# EasyEDA Pro project ProPrj_nrf52board_2026-05-24.epro

# Schematic Schematic1
Board Name: Board1; Create Date: 2026-05-19; Page Name: P1; Project Name: nrf52board; Schematic Name: Schematic1; Update Date: 2026-05-21; Company: EasyEDA.com; Page Size: A4; Version: V1.0
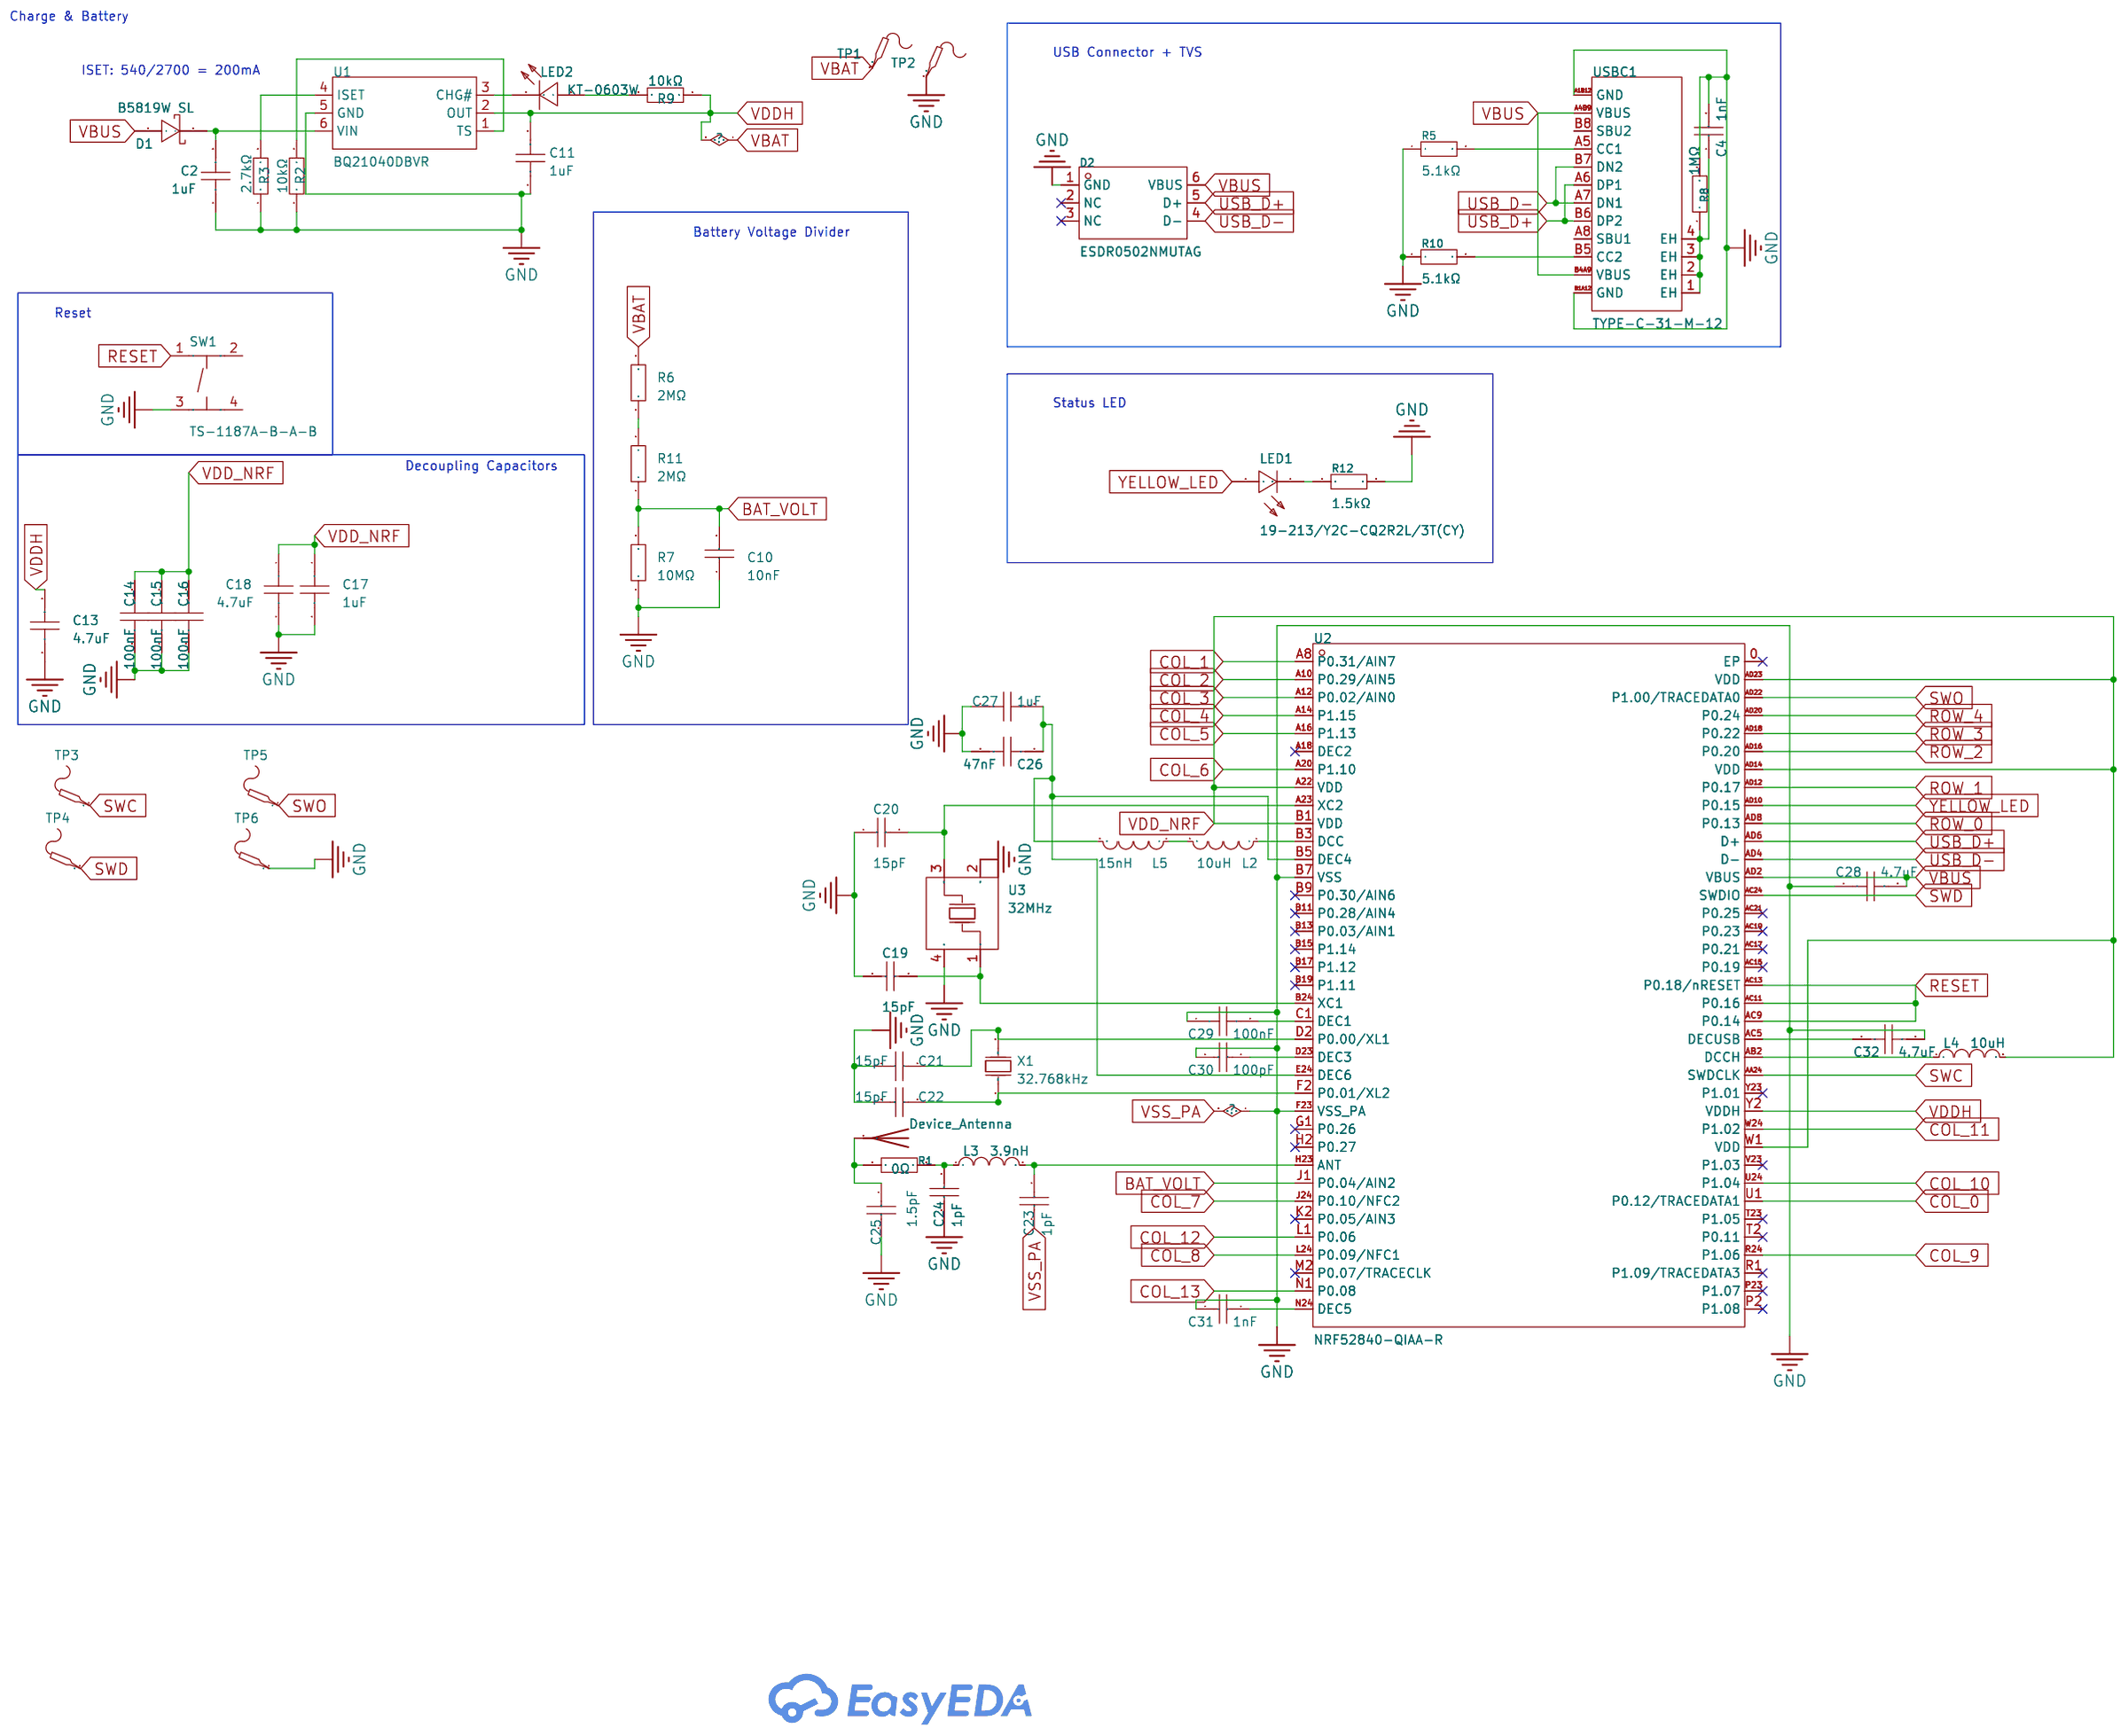
[diagram p0: schematic sheet]

## Parts
AE1  Antenna  [Mikoto-Footprints:2.4GHz-meander-antenna-v2]
C2  1uF  [C0402]
C4  1nF  [C0402]
C10  10nF  [C0402]
C11  1uF  [C0402]
C13  4.7uF  [C0402]
C14  100nF  [C0402]
C15  100nF  [C0402]
C16  100nF  [C0402]
C17  1uF  [C0402]
C18  4.7uF  [C0402]
C19  15pF  [C0402]
C20  15pF  [C0402]
C21  15pF  [C0402]
C22  15pF  [C0402]
C23  1pF  [C0402]
C24  1pF  [C0402]
C25  1.5pF  [C0402]
C26  47nF  [C0402]
C27  1uF  [C0402]
C28  4.7uF  [C0402]
C29  100nF  [C0402]
C30  100pF  [C0402]
C31  1nF  [C0402]
C32  4.7uF  [C0402]
D1  B5819W SL  [SOD-123_L2.7-W1.6-LS3.7-RD-1]
D2  ESDR0502NMUTAG  [UDFN-6_L1.2-W1.0-P0.40-BL]
L2  10uH  [L0603]
L3  3.9nH  [L0402]
L4  10uH  [L0603]
L5  15nH  [L0603]
LED1  19-213/Y2C-CQ2R2L/3T(CY)  [LED0603-RD-YELLOW]
LED2  KT-0603W  [LED0603-R-RD_WHITE]
R1  0Ω  [R0402]
R2  10kΩ  [R0402]
R3  2.7kΩ  [R0603]
R5  5.1kΩ  [R0402]
R6  2MΩ  [R0603]
R7  10MΩ  [R0402]
R8  1MΩ  [R0402]
R9  10kΩ  [R0402]
R10  5.1kΩ  [R0402]
R11  2MΩ  [R0603]
R12  1.5kΩ  [R0402]
SW1  TS-1187A-B-A-B  [SW-SMD_4P-L5.1-W5.1-P3.70-LS6.5-TL_H1.5]
TP1  -  [Test-Point-0.5mm]
TP2  -  [Test-Point-0.5mm]
TP3  -  [Test-Point-0.5mm]
TP4  -  [Test-Point-0.5mm]
TP5  -  [Test-Point-0.5mm]
TP6  -  [Test-Point-0.5mm]
U1  BQ21040DBVR  [SOT-23-6_L2.9-W1.6-P0.95-LS2.8-BR]
U2  NRF52840-QIAA-R  [AQFN-73_L7.0-W7.0-P0.50-BL-EP4.8]
U3  32MHz  [CRYSTAL-SMD_4P-L2.0-W1.6-BL-2]
USBC1  TYPE-C-31-M-12  [USB-C_SMD-TYPE-C-31-M-12_1]
X1  32.768kHz  [FC-12M_L2.0-W1.2]

## Library data of the parts
AE1 = Device_Antenna
C2 C11 C17 C27 = CL05A105KA5NQNC: Capacitance:1uF Tolerance:±10% Tolerance:±10% Voltage Rating:25V Temperature Coefficient:X5R; LCSC Part Name: 1uF ±10% 25V; Supplier Part: C52923; Manufacturer: SAMSUNG(三星); Supplier Footprint: 0402; Datasheet: https://item.szlcsc.com/datasheet/CL05A105KA5NQNC/53938.html; Supplier: LCSC; Tolerance: ±10%; Voltage Rating: 25V; Temperature Coefficient: X5R
C4 C31 = 0402B102K500NT: Capacitance:1nF Tolerance:±10% Tolerance:±10% Voltage Rating:50V Temperature Coefficient:X7R; LCSC Part Name: 1nF ±10% 50V; Supplier Part: C1523; Manufacturer: FH(风华); Supplier Footprint: 0402; Datasheet: https://item.szlcsc.com/datasheet/0402B102K500NT/1875.html; Supplier: LCSC; Tolerance: ±10%; Voltage Rating: 50V; Temperature Coefficient: X7R
C10 = CL05B103KB5NNNC: Capacitance:10nF Tolerance:±10% Tolerance:±10% Voltage Rating:50V Temperature Coefficient:X7R; LCSC Part Name: 10nF ±10% 50V; Supplier Part: C15195; Manufacturer: SAMSUNG(三星); Supplier Footprint: 0402; Datasheet: https://item.szlcsc.com/datasheet/CL05B103KB5NNNC/15869.html; Supplier: LCSC; Tolerance: ±10%; Voltage Rating: 50V; Temperature Coefficient: X7R
C13 C18 C28 C32 = CL05A475MP5NRNC: Capacitance:4.7uF Tolerance:±20% Tolerance:±20% Voltage Rating:10V Temperature Coefficient:X5R; LCSC Part Name: 4.7uF ±20% 10V; Supplier Part: C23733; Manufacturer: SAMSUNG(三星); Supplier Footprint: 0402; Datasheet: https://item.szlcsc.com/datasheet/CL05A475MP5NRNC/24469.html; Supplier: LCSC; Tolerance: ±20%; Voltage Rating: 10V; Temperature Coefficient: X5R
C14-C16 C29 = CL05B104KB54PNC: Capacitance:100nF Tolerance:±10% Tolerance:±10% Voltage Rating:50V Temperature Coefficient:X7R; LCSC Part Name: 100nF ±10% 50V; Supplier Part: C307331; Manufacturer: SAMSUNG(三星); Supplier Footprint: 0402; Datasheet: https://item.szlcsc.com/datasheet/CL05B104KB54PNC/291005.html; Supplier: LCSC; Tolerance: ±10%; Voltage Rating: 50V; Temperature Coefficient: X7R
C19-C22 = 0402CG150J500NT: Capacitance:15pF Tolerance:±5% Tolerance:±5% Voltage Rating:50V Temperature Coefficient:C0G; LCSC Part Name: 15pF ±5% 50V; Supplier Part: C1548; Manufacturer: FH(风华); Supplier Footprint: 0402; Datasheet: https://item.szlcsc.com/datasheet/0402CG150J500NT/1900.html; Supplier: LCSC; Tolerance: ±5%; Voltage Rating: 50V; Temperature Coefficient: C0G
C23 C24 = 0402CG1R0C500NT: Capacitance:1pF Voltage Rating:50V Temperature Coefficient:C0G; LCSC Part Name: ±0.25pF 1pF 50V; Supplier Part: C1550; Manufacturer: FH(风华); Supplier Footprint: 0402; JLCPCB Part Class: Extended Part; Datasheet: https://item.szlcsc.com/datasheet/0402CG1R0C500NT/1902.html; Supplier: LCSC; Voltage Rating: 50V; Temperature Coefficient: C0G
C25 = 0402CG1R5C500NT: Capacitance:1.5pF Voltage Rating:50V Temperature Coefficient:C0G; LCSC Part Name: ±0.25pF 1.5pF 50V; Supplier Part: C1552; Manufacturer: FH(风华); Supplier Footprint: 0402; JLCPCB Part Class: Extended Part; Datasheet: https://item.szlcsc.com/datasheet/0402CG1R5C500NT/1904.html; Supplier: LCSC; Voltage Rating: 50V; Temperature Coefficient: C0G
C26 = CC0402KRX7R9BB473: Capacitance:47nF Tolerance:±10% Tolerance:±10% Voltage Rating:50V Temperature Coefficient:X7R; LCSC Part Name: 47nF ±10% 50V; Supplier Part: C272875; Manufacturer: YAGEO(国巨); Supplier Footprint: 0402; Datasheet: https://item.szlcsc.com/datasheet/CC0402KRX7R9BB473/261267.html; Supplier: LCSC; Tolerance: ±10%; Voltage Rating: 50V; Temperature Coefficient: X7R
C30 = 0402CG101J500NT: Capacitance:100pF Tolerance:±5% Tolerance:±5% Voltage Rating:50V Temperature Coefficient:C0G; LCSC Part Name: 100pF ±5% 50V; Supplier Part: C1546; Manufacturer: FH(风华); Supplier Footprint: 0402; Datasheet: https://item.szlcsc.com/datasheet/0402CG101J500NT/1898.html; Supplier: LCSC; Tolerance: ±5%; Voltage Rating: 50V; Temperature Coefficient: C0G
D1 = B5819W SL: Voltage - Forward(Vf@If):600mV@1A Voltage - DC Reverse(Vr):40V Current - Rectified:1A Non-Repetitive Peak Forward Surge Current:9A; LCSC Part Name: 电压:40V 电流:1A; Supplier Part: C8598; Manufacturer: CJ(江苏长电/长晶); Supplier Footprint: SOD-123; JLCPCB Part Class: Basic Part; Datasheet: https://item.szlcsc.com/datasheet/B5819W%2520SL/9093.html; Supplier: LCSC; Voltage - Forward(Vf@If): 600mV@1A; Voltage - DC Reverse(Vr): 40V; Current - Rectified: 1A; Non-Repetitive Peak Forward Surge Current: 9A
D2 = ESDR0502NMUTAG: Polarity:Unidirectional Reverse Stand-Off Voltage (Vrwm):5.5V Clamping Voltage:- Peak Pulse Current (Ipp):3A@8/20us Peak Pulse Power Dissipation (Ppp):100W Voltage - Breakdown:6V Reverse Leakage Current (Ir):1uA Number of Channels:3.0 Operating Temperatur; LCSC Part Name: 单向ESD 5.5V截止 峰值脉冲电流：3A@8/20us; Supplier Part: C94372; Manufacturer: onsemi(安森美); Supplier Footprint: UDFN-6(1x1.2); Datasheet: https://item.szlcsc.com/datasheet/ESDR0502NMUTAG/95570.html; Supplier: LCSC; Polarity: Unidirectional; Reverse Stand-Off Voltage (Vrwm): 5.5V; Peak Pulse Current (Ipp): 3A@8/20us; Peak Pulse Power Dissipation (Ppp): 100W; Voltage - Breakdown: 6V; Reverse Leakage Current (Ir): 1uA; Number of Channels: 3.0; Operating Temperature: -40℃~+125℃@(Tj); level of protection: IEC 61000-4-2; Type: ESD; Junction Capacitance: 0.3pF
L2 L4 = MLF1608E100KTD00: Inductance: Tolerance:±10% Tolerance:±10% Rated Current: Saturation Current (Isat):- DC Resistance (DCR): Q @ Freq:30@2MHz Frequency - Self Resonant: Ratings:; LCSC Part Name: 10uH ±10%; Supplier Part: C76732; Manufacturer: TDK; Supplier Footprint: 0603; JLCPCB Part Class: Extended Part; Datasheet: https://atta.szlcsc.com/upload/public/pdf/source/20181114/C275341_888357AD71868412430D27D805FD440F.pdf; Supplier: LCSC; Tolerance: ±10%; Q @ Freq: 30@2MHz
L3 = MLG1005S3N9BT000: Inductance: Tolerance:- Tolerance:- Current Rating: Current - Saturation (Isat):- DC Resistance(DCR): Q @ Frequency:8@100MHz Frequency - Self Resonant:5GHz Ratings:; LCSC Part Name: ±0.1nH 3.9nH; Supplier Part: C76775; Manufacturer: TDK; Supplier Footprint: 0402; Datasheet: https://atta.szlcsc.com/upload/public/pdf/source/20240116/5498F69597B6145D9954BDAE22913204.pdf; Supplier: LCSC; Q @ Frequency: 8@100MHz; Frequency - Self Resonant: 5GHz
L5 = MLG1005S15NJT000: Inductance: Tolerance:±5% Tolerance:±5% Rated Current: Saturation Current (Isat):- DC Resistance (DCR): Q @ Freq:8@100MHz Frequency - Self Resonant: Ratings:; LCSC Part Name: 15nH ±5%; Supplier Part: C76763; Manufacturer: TDK; Supplier Footprint: 0402; Datasheet: https://atta.szlcsc.com/upload/public/pdf/source/20190403/C275259_14D38AC9DF218780897673DFAA345BA3.pdf; Supplier: LCSC; Tolerance: ±5%; Q @ Freq: 8@100MHz
LED1 = 19-213/Y2C-CQ2R2L/3T(CY): Lamp Holder Type:- Illumination Color:Yellow Voltage - Forward(Vf):1.7V~2.3V Voltage - Forward(Vf):1.7V~2.3V Power(Watts):60mW Forward Current:20mA Wavelength - Dominant:585.5nm~591.5nm Wavelength - Dominant:585.5nm~591.5nm Peak Wavelength:591nm Peak Wave; LCSC Part Name: 黄灯; Supplier Part: C72038; Manufacturer: EVERLIGHT(亿光); Supplier Footprint: 0603; Supplier: LCSC; Illumination Color: Yellow; Voltage - Forward(Vf): 1.7V~2.3V; Power(Watts): 60mW; Forward Current: 20mA; Wavelength - Dominant: 585.5nm~591.5nm; Peak Wavelength: 591nm; Lens Color: Water Clear; Luminous Intensity: 90mcd~180mcd; Viewing Angle: 120°; Operating Temperature: -40℃~+85℃
LED2 = KT-0603W: Lamp Holder Type:1.6mm x 0.8mm square LED Illumination Color:White Voltage - Forward(Vf):2.6V~3.1V Voltage - Forward(Vf):2.6V~3.1V Power(Watts):100mW Forward Current:5mA Wavelength - Dominant:- Wavelength - Dominant:- Peak Wavelength:- Peak Wavelength:- D; LCSC Part Name: 0603 白灯 高亮; Supplier Part: C2290; Manufacturer: KENTO; Supplier Footprint: 0603; Datasheet: https://item.szlcsc.com/datasheet/KT-0603W/2663.html; Supplier: LCSC; Lamp Holder Type: 1.6mm x 0.8mm square LED; Illumination Color: White; Voltage - Forward(Vf): 2.6V~3.1V; Power(Watts): 100mW; Forward Current: 5mA; Diode Configuration: Discrete Diode; Lens Color: Yellow Lens; Color Temperature: 40000K~100000K; Luminous Intensity: 360mcd; Viewing Angle: 120°; Mounting Style: Top-mount; Operating Temperature: -40℃~+85℃
R1 = 0402WGF0000TCE: Type:Thick Film Resistor Resistance:0Ω Tolerance:±1% Tolerance:±1% Power(Watts):62.5mW Voltage-Supply(Max):50V Temperature Coefficient:±800ppm/℃ Temperature Coefficient:±800ppm/℃ Operating Temperature:-55℃~+155℃ Operating Temperature:-55℃~+155℃; LCSC Part Name: 0Ω ±1% 62.5mW 厚膜电阻; Supplier Part: C17168; Manufacturer: UNI-ROYAL(厚声); Supplier Footprint: 0402; Datasheet: https://item.szlcsc.com/datasheet/0402WGF0000TCE/17853.html; Supplier: LCSC; Type: Thick Film Resistor; Tolerance: ±1%; Power(Watts): 62.5mW; Voltage-Supply(Max): 50V; Temperature Coefficient: ±800ppm/℃; Operating Temperature: -55℃~+155℃
R2 R9 = 0402WGF1002TCE: Type:Thick Film Resistor Resistance:10kΩ Tolerance:±1% Tolerance:±1% Power(Watts):62.5mW Voltage-Supply(Max):50V Temperature Coefficient:±100ppm/℃ Temperature Coefficient:±100ppm/℃ Operating Temperature:-55℃~+155℃ Operating Temperature:-55℃~+155℃; LCSC Part Name: 10kΩ ±1% 62.5mW 厚膜电阻; Supplier Part: C25744; Manufacturer: UNI-ROYAL(厚声); Supplier Footprint: 0402; Datasheet: https://item.szlcsc.com/datasheet/0402WGF1002TCE/26487.html; Supplier: LCSC; Type: Thick Film Resistor; Tolerance: ±1%; Power(Watts): 62.5mW; Voltage-Supply(Max): 50V; Temperature Coefficient: ±100ppm/℃; Operating Temperature: -55℃~+155℃
R3 = 0603WAF2701T5E: Type:Thick Film Resistor Resistance:2.7kΩ Tolerance:±1% Tolerance:±1% Power(Watts):100mW Voltage-Supply(Max):75V Temperature Coefficient:±100ppm/℃ Temperature Coefficient:±100ppm/℃ Operating Temperature:-55℃~+155℃ Operating Temperature:-55℃~+155℃; LCSC Part Name: 2.7kΩ ±1% 100mW 厚膜电阻; Supplier Part: C13167; Manufacturer: UNI-ROYAL(厚声); Supplier Footprint: 0603; Datasheet: https://item.szlcsc.com/datasheet/0603WAF2701T5E/13814.html; Supplier: LCSC; Type: Thick Film Resistor; Tolerance: ±1%; Power(Watts): 100mW; Voltage-Supply(Max): 75V; Temperature Coefficient: ±100ppm/℃; Operating Temperature: -55℃~+155℃
R5 R10 = 0402WGF5101TCE: Type:Thick Film Resistor Resistance:5.1kΩ Tolerance:±1% Tolerance:±1% Power(Watts):62.5mW Voltage-Supply(Max):50V Temperature Coefficient:±100ppm/℃ Temperature Coefficient:±100ppm/℃ Operating Temperature:-55℃~+155℃ Operating Temperature:-55℃~+155℃; LCSC Part Name: 5.1kΩ ±1% 62.5mW 厚膜电阻; Supplier Part: C25905; Manufacturer: UNI-ROYAL(厚声); Supplier Footprint: 0402; Datasheet: https://item.szlcsc.com/datasheet/0402WGF5101TCE/26648.html; Supplier: LCSC; Type: Thick Film Resistor; Tolerance: ±1%; Power(Watts): 62.5mW; Voltage-Supply(Max): 50V; Temperature Coefficient: ±100ppm/℃; Operating Temperature: -55℃~+155℃
R6 R11 = 0603WAF2004T5E: Type:Thick Film Resistor Resistance:2MΩ Tolerance:±1% Tolerance:±1% Power(Watts):100mW Voltage-Supply(Max):75V Temperature Coefficient:±100ppm/℃ Temperature Coefficient:±100ppm/℃ Operating Temperature:-55℃~+155℃ Operating Temperature:-55℃~+155℃; LCSC Part Name: 2MΩ ±1% 100mW 厚膜电阻; Supplier Part: C22976; Manufacturer: UNI-ROYAL(厚声); Supplier Footprint: 0603; Datasheet: https://item.szlcsc.com/datasheet/0603WAF2004T5E/23703.html; Supplier: LCSC; Type: Thick Film Resistor; Tolerance: ±1%; Power(Watts): 100mW; Voltage-Supply(Max): 75V; Temperature Coefficient: ±100ppm/℃; Operating Temperature: -55℃~+155℃
R7 = 0402WGF1005TCE: Type:Thick Film Resistor Resistance:10MΩ Tolerance:±1% Tolerance:±1% Power(Watts):62.5mW Voltage-Supply(Max):50V Temperature Coefficient:±200ppm/℃ Temperature Coefficient:±200ppm/℃ Operating Temperature:-55℃~+155℃ Operating Temperature:-55℃~+155℃; LCSC Part Name: 10MΩ ±1% 62.5mW 厚膜电阻; Supplier Part: C26082; Manufacturer: UNI-ROYAL(厚声); Supplier Footprint: 0402; Datasheet: https://item.szlcsc.com/datasheet/0402WGF1005TCE/26825.html; Supplier: LCSC; Type: Thick Film Resistor; Tolerance: ±1%; Power(Watts): 62.5mW; Voltage-Supply(Max): 50V; Temperature Coefficient: ±200ppm/℃; Operating Temperature: -55℃~+155℃
R8 = 0402WGF1004TCE: Type:Thick Film Resistor Resistance:1MΩ Tolerance:±1% Tolerance:±1% Power(Watts):62.5mW Voltage-Supply(Max):50V Temperature Coefficient:±100ppm/℃ Temperature Coefficient:±100ppm/℃ Operating Temperature:-55℃~+155℃ Operating Temperature:-55℃~+155℃; LCSC Part Name: 1MΩ ±1% 62.5mW 厚膜电阻; Supplier Part: C26083; Manufacturer: UNI-ROYAL(厚声); Supplier Footprint: 0402; Datasheet: https://item.szlcsc.com/datasheet/0402WGF1004TCE/26826.html; Supplier: LCSC; Type: Thick Film Resistor; Tolerance: ±1%; Power(Watts): 62.5mW; Voltage-Supply(Max): 50V; Temperature Coefficient: ±100ppm/℃; Operating Temperature: -55℃~+155℃
R12 = 0402WGF1501TCE: Type:Thick Film Resistors Resistance:1.5kΩ Tolerance:±1% Tolerance:±1% Power(Watts): Overload Voltage (Max): Temperature Coefficient:±100ppm/℃ Temperature Coefficient:±100ppm/℃ Operating Temperature Range:-55℃~+155℃ Operating Temperature Range:-55℃~+155℃; LCSC Part Name: 1.5kΩ ±1% 62.5mW 厚膜电阻; Supplier Part: C25867; Manufacturer: UNI-ROYAL(厚声); Supplier Footprint: 0402; Datasheet: https://atta.szlcsc.com/upload/public/pdf/source/20200306/C422600_1E6D84923E4A46A82E41ADD87F860B5C.pdf; Supplier: LCSC; Type: Thick Film Resistors; Tolerance: ±1%; Temperature Coefficient: ±100ppm/℃; Operating Temperature Range: -55℃~+155℃
SW1 = TS-1187A-B-A-B: Circuit:SPST Actuator Style:Round Button Operating Force:1.6N Mounting Type:Surface Mount,Vertical Length:5.1mm Width:5.1mm Switch Height:1.5mm with Bracket:Without Bracket Contact Current:50mA Voltage Rating:12V Actuator/Cap Color:Gold With Lamp:No Life:; LCSC Part Name: 5.1*5.1*1.5mm 立贴 轻触开关; Supplier Part: C318884; Manufacturer: XKB Connection(中国星坤); Supplier Footprint: SMD; Datasheet: https://item.szlcsc.com/datasheet/TS-1187A-B-A-B/299976.html; Supplier: LCSC; Circuit: SPST; Actuator Style: Round Button; Operating Force: 1.6N; Mounting Type: Surface Mount,Vertical; Length: 5.1mm; Width: 5.1mm; Switch Height: 1.5mm; with Bracket: Without Bracket; Contact Current: 50mA; Voltage Rating: 12V; Actuator/Cap Color: Gold; With Lamp: No; Life: 100,000 Cycles; Operating Temperature: -30℃~+85℃
TP1-TP6 = Test-Point: Test Point 测试点
U1 = BQ21040DBVR: The Chip Type:Charging IC Voltage - Supply:3.5V~28V Voltage - Supply:3.5V~28V Charge Current - Max:800mA Charging Saturation Voltage:4.2V End-Off Voltage:- Type of Battery:Lithium Battery Number of Cells:1 Number of Cells:1 Operating Temperature:0℃~+125℃; LCSC Part Name: 单输入单节锂离子和锂聚合物电池充电器; Supplier Part: C202311; Manufacturer: TI(德州仪器); Supplier Footprint: SOT-23-6; Datasheet: https://www.ti.com/cn/lit/gpn/bq21040; Supplier: LCSC; The Chip Type: Charging IC; Voltage - Supply: 3.5V~28V; Charge Current - Max: 800mA; Charging Saturation Voltage: 4.2V; Type of Battery: Lithium Battery; Number of Cells: 1; Operating Temperature: 0℃~+125℃; Battery Temperature Detection: Support; Supply Current (Iq): 125uA
U2 = NRF52840-QIAA-R: Frequency Range:2.4GHz~2.4835GHz Frequency Range:2.4GHz~2.4835GHz Interface:ADC；SPI；PWM；I2S；USB；UART Voltage - Supply:1.7V~5.5V Voltage - Supply:1.7V~5.5V Applications:ISM；Bluetooth；ZigBee；IoT；LoRa Output Power:8dBm Data Rate:2Mbps Current Of Transmitting; LCSC Part Name: 蓝牙，IEEE 802.15.4-2006，2.4GHz收发器; Supplier Part: C190794; Manufacturer: NORDIC; Supplier Footprint: AQFN-73-EP(7x7); Datasheet: https://item.szlcsc.com/datasheet/NRF52840-QIAA-R/213038.html; Supplier: LCSC; Frequency Range: 2.4GHz~2.4835GHz; Interface: ADC；SPI；PWM；I2S；USB；UART; Voltage - Supply: 1.7V~5.5V; Applications: ISM；Bluetooth；ZigBee；IoT；LoRa; Output Power: 8dBm; Data Rate: 2Mbps; Current Of Transmitting: 4.82mA; Sensitivity: -95dBm; Receive Current: 6.26mA; Typical Application Frequency: 2.4GHz; Type: transceiver
U3 = XL7EL89COI-111YLC-32M: Type:Crystal Oscillator Frequency:32MHz Normal temperature Frequency Tolerance:±10ppm Normal temperature Frequency Tolerance:±10ppm Load Capacitance:12pF Frequency Stability:±20ppm Frequency Stability:±20ppm Equivalent Series Resistance(ESR):- Operating T; LCSC Part Name: YSX211SL 32MHZ 12PF ±10PPM -40~85℃; Supplier Part: C2965584; Manufacturer: YXC(扬兴晶振); Supplier Footprint: SMD2016-4P; Datasheet: https://item.szlcsc.com/datasheet/XL7EL89COI-111YLC-32M/3357720.html; Supplier: LCSC; Type: Crystal Oscillator; Normal temperature Frequency Tolerance: ±10ppm; Load Capacitance: 12pF; Frequency Stability: ±20ppm; Operating Temperature: -40℃~+85℃
USBC1 = TYPE-C-31-M-12: Connector Type:Type-C Protocol Standard:- Gender:Female Mounting Type:Surface Mount, Right Angle Number of Contacts:16P Number of Ports:1 Current Rating-Power:5A Voltage Rating:20V Connect-Disconnect Life:10,000 cycles Length:7.35mm Operating Temperature:; LCSC Part Name: Type-C 母 卧贴; Supplier Part: C165948; Manufacturer: 韩国韩荣; Supplier Footprint: SMD; Datasheet: https://item.szlcsc.com/datasheet/TYPE-C-31-M-12/177331.html; Supplier: LCSC; Connector Type: Type-C; Gender: Female; Mounting Type: Surface Mount, Right Angle; Number of Contacts: 16P; Number of Ports: 1; Current Rating-Power: 5A; Voltage Rating: 20V; Connect-Disconnect Life: 10,000 cycles; Length: 7.35mm; Operating Temperature: -30℃~+80℃
X1 = X1A0000610006: Type:Crystal Oscillator Frequency:32.768kHz Normal temperature Frequency Tolerance:±20ppm Normal temperature Frequency Tolerance:±20ppm Load Capacitance:7pF Equivalent Series Resistance(ESR):90kΩ Operating Temperature:-40℃~+85℃ Operating Temperature:-40℃~; LCSC Part Name: 32.768kHz ±20ppm 7pF; Supplier Part: C99009; Manufacturer: EPSON(爱普生); Supplier Footprint: SMD2012-2P; Datasheet: https://item.szlcsc.com/datasheet/X1A0000610006/100221.html; Supplier: LCSC; Type: Crystal Oscillator; Normal temperature Frequency Tolerance: ±20ppm; Load Capacitance: 7pF; Equivalent Series Resistance(ESR): 90kΩ; Operating Temperature: -40℃~+85℃

## Nets
GND: C2.1 C4.2 C10.1 C11.1 C13.1 C14.1 C15.1 C16.1 C17.2 C18.2 C19.1 C20.1 C21.1 C22.1 C23.1 C24.1 C25.1 C26.2 C27.1 C28.1 C29.1 C30.1 C31.1 C32.2 D2.1(GND) R2.1 R3.1 R5.1 R7.1 R8.2 R10.1 R12.2 SW1.3(C) TP2.1 TP6.1 U1.5(GND) U2.B7(VSS) U2.F23(VSS_PA) U3.2(GND) U3.4(GND) USBC1.A1B12(GND) USBC1.B1A12(GND)
VBAT: C11.2 C13.2 R6.2 R9.1 TP1.1 U1.2(OUT) U2.Y2(VDDH)
VBUS: C28.2 D1.2(+) D2.6(VBUS) U2.AD2(VBUS) USBC1.A4B9(VBUS) USBC1.B4A9(VBUS)
VDD_NRF: C14.2 C15.2 C16.2 C17.1 C18.1 L4.2 U2.A22(VDD) U2.AD14(VDD) U2.AD23(VDD) U2.B1(VDD) U2.W1(VDD)
BAT_VOLT: C10.2 R7.2 R11.1 U2.J1(P0.04/AIN2)
COL_0: U2.U1(P0.12/TRACEDATA1)
COL_1: U2.A8(P0.31/AIN7)
COL_2: U2.A10(P0.29/AIN5)
COL_3: U2.A12(P0.02/AIN0)
COL_4: U2.A14(P1.15)
COL_5: U2.A16(P1.13)
COL_6: U2.A20(P1.10)
COL_7: U2.J24(P0.10/NFC2)
COL_8: U2.L24(P0.09/NFC1)
COL_9: U2.R24(P1.06)
COL_10: U2.U24(P1.04)
COL_11: U2.W24(P1.02)
COL_12: U2.L1(P0.06)
COL_13: U2.N1(P0.08)
RESET: SW1.1(A) U2.AC9(P0.14) U2.AC11(P0.16) U2.AC13(P0.18/nRESET)
ROW_0: U2.AD8(P0.13)
ROW_1: U2.AD12(P0.17)
ROW_2: U2.AD16(P0.20)
ROW_3: U2.AD18(P0.22)
ROW_4: U2.AD20(P0.24)
SWC: TP3.1 U2.AA24(SWDCLK)
SWD: TP4.1 U2.AC24(SWDIO)
SWO: TP5.1 U2.AD22(P1.00/TRACEDATA0)
USB_D+: D2.5(D+) U2.AD6(D+) USBC1.A6(DP1) USBC1.B6(DP2)
USB_D-: D2.4(D-) U2.AD4(D-) USBC1.A7(DN1) USBC1.B7(DN2)
YELLOW_LED: LED1.2(A) U2.AD10(P0.15)
$1N6787: R2.2 U1.1(TS)
$1N6836: R3.2 U1.4(ISET)
$1N6843: C2.2 D1.1(-) U1.6(VIN)
$1N6965: LED2.2(K) U1.3(CHG#)
$1N7006: LED2.1(A) R9.2
$1N7414: R10.2 USBC1.B5(CC2)
$1N7418: R5.2 USBC1.A5(CC1)
$1N7519: C4.1 R8.1 USBC1.1(EH) USBC1.2(EH) USBC1.3(EH) USBC1.4(EH)
$1N7677: R6.1 R11.2
$1N7805: LED1.1(C) R12.1
$1N8689: C20.2 U2.A23(XC2) U3.3(OSC2)
$1N8693: C19.2 U2.B24(XC1) U3.1(OSC1)
$1N8922: C21.2 U2.D2(P0.00/XL1) X1.2(OSC2)
$1N8937: C22.2 U2.F2(P0.01/XL2) X1.1(OSC1)
$1N9163: C23.2 L3.2 U2.H23(ANT)
$1N9226: C24.2 L3.1 R1.2
$1N9400: L4.1 U2.AB2(DCCH)
$1N9460: L2.1 U2.B3(DCC)
$1N9502: L2.2 L5.1
$1N9506: C26.1 C27.2 L5.2 U2.B5(DEC4) U2.E24(DEC6)
$1N9889: C29.2 U2.C1(DEC1)
$1N9928: C30.2 U2.D23(DEC3)
$1N9989: C31.2 U2.N24(DEC5)
$1N10054: C32.1 U2.AC5(DECUSB)
Net-(AE1-1): AE1.1(A) C25.2 R1.1

Not connected (* = marked no-connect by the designer): D2 2(NC)* 3(NC)*; SW1 2(B) 4(D); U2 0(EP)* A18(DEC2)* AC15(P0.19)* AC17(P0.21)* AC19(P0.23)* AC21(P0.25)* B9(P0.30/AIN6)* B11(P0.28/AIN4)* B13(P0.03/AIN1)* B15(P1.14)* B17(P1.12)* B19(P1.11)* G1(P0.26)* H2(P0.27)* K2(P0.05/AIN3)* M2(P0.07/TRACECLK)* P2(P1.08)* P23(P1.07)* R1(P1.09/TRACEDATA3)* T2(P0.11)* T23(P1.05)* V23(P1.03)* Y23(P1.01)*; USBC1 A8(SBU1) B8(SBU2)

## Notes on the sheet
- Charge & Battery
- USB Connector + TVS
- ISET: 540/2700 = 200mA
- Battery Voltage Divider
- Reset
- Status LED
- Decoupling Capacitors

# Board PCB1
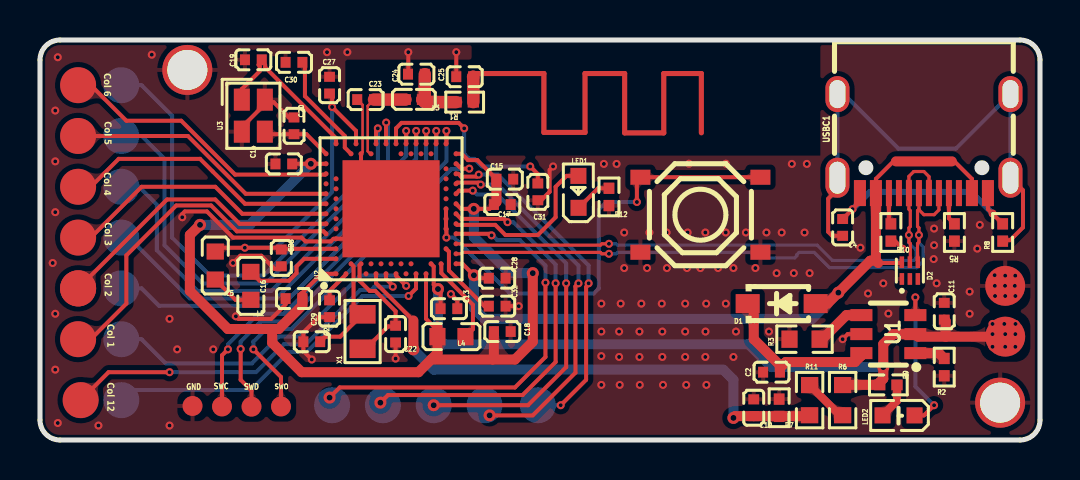
[diagram p1: board, top side]
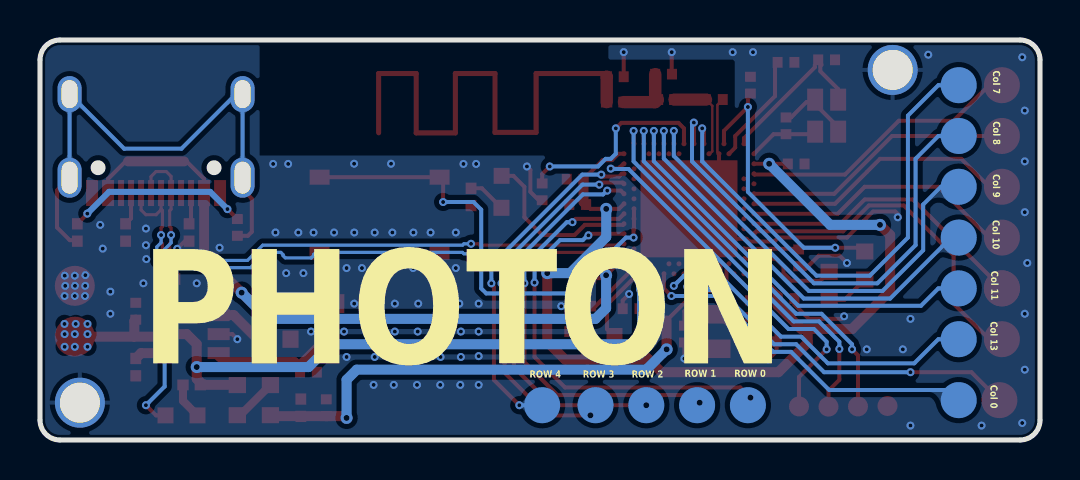
[diagram p2: board, bottom side, seen from below]

Outline 50 x 20 mm; copper layers: Top Layer, Bottom Layer. Coordinates in mm from the lower left corner of the outline.
Outline path: 0,19 0,1 arc(0.29,0.29) 1,0 49,0 arc(49.71,0.29) 50,1 50,19 arc(49.71,19.71) 49,20 1,20 arc(0.29,19.71) 0,19
Stack: Top Layer 0.035mm / Dielectric1 1.51mm FR4 er 4.5 / Bottom Layer 0.035mm

## Design rules (mm)
net USB_D-: DP1
net USB_D+: DP1
template: Custom Config
spacing copperThickness1oz (default): track to track 0.1, other pairs 0.1 to 0.3
spacing copperThickness2oz: track to track 0.203, other pairs 0.152 to 0.3
track width copperThickness1oz (default): min 0.127, default 0.2, max 2.54
track width copperThickness2oz: min 0.203, default 0.254, max 2.54
differential pair differentialPair (default): width min 0.127, default 0.158, max 2.54; gap min 0.203, default 0.203
via viaSize (default): diameter min 0.4, default 0.4, max 10; hole min 0.2, default 0.2, max 6.3

## Placement (name value [footprint] x y rotation side)
AE1  Antenna  [mikoto-footprints:2.4GHz-meander-antenna-v2]  28.19 16.85 180 top
C2  1uF  [C0402]  36.58 3.39 0 top
C4  1nF  [C0402]  40.13 10.63 90 top
C10  10nF  [C0402]  35.69 1.61 270 top
C11  1uF  [C0402]  45.21 6.44 270 top
C13  4.7uF  [C0402]  20.45 6.56 180 top
C14  100nF  [C0402]  12.19 13.8 0 top
C15  100nF  [C0402]  23.24 13.04 180 top
C16  100nF  [C0402]  12.7 7.07 0 top
C17  1uF  [C0402]  23.11 11.77 0 top
C18  4.7uF  [C0402]  23.11 5.42 0 top
C19  15pF  [C0402]  10.67 19.01 0 top
C20  15pF  [C0402]  12.7 15.71 270 top
C21  15pF  [C0402]  13.59 4.91 0 top
C22  15pF  [C0402]  17.78 5.3 90 top
C23  1pF  [C0402]  16.28 17.02 0 top
C24  1pF  [C0402]  18.82 18.29 0 top
C25  1.5pF  [C0402]  21.23 18.16 0 top
C26  47nF  [C0402]  12.06 9.11 270 top
C27  1uF  [C0402]  14.48 17.74 270 top
C28  4.7uF  [C0402]  22.86 8.09 180 top
C29  100nF  [C0402]  14.48 6.56 90 top
C30  100pF  [C0402]  12.7 18.88 0 top
C31  1nF  [C0402]  24.89 12.41 90 top
C32  4.7uF  [C0402]  22.86 6.69 0 top
D1  B5819W SL  [SOD-123_L2.7-W1.6-LS3.7-RD-1]  37.08 6.82 0 top
D2  ESDR0502NMUTAG  [UDFN-6_L1.2-W1.0-P0.40-BL]  43.49 8.47 0 top
GND  -  [Test-Point-0.5mm]  7.63 1.7 0 top
L2  10uH  [L0603]  10.54 7.71 270 top
L3  3.9nH  [L0402]  18.69 17.02 180 top
L4  10uH  [L0603]  20.57 5.17 180 top
L5  15nH  [L0603]  8.76 8.72 90 top
LED1  19-213/Y2C-CQ2R2L/3T(CY)  [LED0603-RD-YELLOW]  26.92 12.41 90 top
LED2  KT-0603W  [LED0603-R-RD_WHITE]  42.93 1.23 180 top
NOREF  -  [Pad_e2406]  1.91 5.04 0 top
NOREF#2  -  [Pad_e2405]  4.06 17.74 0 top
NOREF#3  -  [Pad_e632]  48.26 7.71 90 top
NOREF#4  -  [Pad_e2399]  4.06 5.04 0 top
NOREF#5  -  [Pad_e629]  48.26 5.17 90 top
NOREF#6  -  [Pad_e2394]  22.22 1.74 0 top
NOREF#7  -  [Pad_e2409]  1.91 10.12 0 top
NOREF#8  -  [Pad_e2395]  19.69 1.74 0 top
NOREF#9  -  [Pad_e2411]  1.91 15.2 0 top
NOREF#10  -  [Pad_e2401]  4.06 7.58 0 top
NOREF#11  -  [Pad_e2404]  4.06 15.2 0 top
NOREF#12  -  [Pad_e2410]  1.91 12.66 0 top
NOREF#13  -  [Pad_e2392]  24.89 1.74 0 top
NOREF#14  -  [Pad_e2397]  14.61 1.74 0 top
NOREF#15  -  [Pad_e7702]  7.37 18.5 0 top
NOREF#16  -  [Pad_e1312]  48.01 1.87 0 top
NOREF#17  -  [Pad_e2407]  1.91 7.58 0 top
NOREF#18  -  [Pad_e2398]  4.06 1.99 0 top
NOREF#19  -  [Pad_e2403]  4.06 12.66 0 top
NOREF#20  -  [Pad_e2402]  4.06 10.12 0 top
NOREF#21  -  [Pad_e2408]  1.91 7.58 0 top
NOREF#22  -  [Pad_e2396]  17.15 1.74 0 top
NOREF#23  -  [Pad_e2400]  2.03 1.99 0 top
NOREF#24  -  [Pad_e2412]  1.91 17.74 0 top
R1  0Ω  [R0402]  21.23 16.89 180 top
R2  10kΩ  [R0402]  45.21 3.64 90 top
R3  2.7kΩ  [R0603]  38.23 5.04 0 top
R5  5.1kΩ  [R0402]  45.72 10.38 90 top
R6  2MΩ  [R0603]  40.13 1.99 90 top
R7  10MΩ  [R0402]  36.96 1.61 270 top
R8  1MΩ  [R0402]  48.13 10.38 90 top
R9  10kΩ  [R0402]  42.42 2.75 0 top
R10  5.1kΩ  [R0402]  42.55 10.38 90 top
R11  2MΩ  [R0603]  38.48 1.99 90 top
R12  1.5kΩ  [R0402]  28.45 12.15 270 top
SW1  TS-1187A-B-A-B  [SW-SMD_4P-L5.1-W5.1-P3.70-LS6.5-TL_H1.5]  33.02 11.26 0 top
SWC  -  [Test-Point-0.5mm]  9.1 1.68 0 top
SWD  -  [Test-Point-0.5mm]  10.58 1.67 0 top
SWO  -  [Test-Point-0.5mm]  12.05 1.68 0 top
U1  BQ21040DBVR  [SOT-23-6_L2.9-W1.6-P0.95-LS2.8-BR]  42.42 5.3 0 top
U2  NRF52840-QIAA-R  [AQFN-73_L7.0-W7.0-P0.50-BL-EP4.8]  17.55 11.56 0 top
U3  32MHz  [CRYSTAL-SMD_4P-L2.0-W1.6-BL-2]  10.67 16.22 270 top
USBC1  TYPE-C-31-M-12  [USB-C_SMD-TYPE-C-31-M-12_1]  44.2 14.82 180 top
X1  32.768kHz  [FC-12M_L2.0-W1.2]  16.13 5.42 90 top

## Footprints (pads in the part's own frame, mm; a bottom-side part is the same pattern mirrored in y, then rotated)
AQFN-73_L7.0-W7.0-P0.50-BL-EP4.8
  rect 4.85x4.85 smd: 0(0,0)
  round 0.25 smd: A8(-3.25,-1.25) A10(-3.25,-0.75) A12(-3.25,-0.25) A14(-3.25,0.25) A16(-3.25,0.75) A18(-3.25,1.25) A20(-3.25,1.75) A22(-3.25,2.25) A23(-3.25,2.75) AA24(2.25,3.25) AB2(2.5,-2.75) AC5(2.75,-2) AC9(2.75,-1) AC11(2.75,-0.5) AC13(2.75,0) AC15(2.75,0.5) AC17(2.75,1) AC19(2.75,1.5) AC21(2.75,2) AC24(2.75,3.25) AD2(3.25,-2.75) AD4(3.25,-2.25) AD6(3.25,-1.75) AD8(3.25,-1.25) AD10(3.25,-0.75) AD12(3.25,-0.25) AD14(3.25,0.25) AD16(3.25,0.75) AD18(3.25,1.25) AD20(3.25,1.75) AD22(3.25,2.25) AD23(3.25,2.75) B1(-2.75,-3.25) B3(-2.75,-2.5) B5(-2.75,-2) B7(-2.75,-1.5) B9(-2.75,-1) B11(-2.75,-0.5) B13(-2.75,0) B15(-2.75,0.5) B17(-2.75,1) B19(-2.75,1.5) B24(-2.75,3.25) C1(-2.25,-3.25) D2(-2,-2.75) D23(-2,2.75) E24(-1.75,3.25) F2(-1.5,-2.75) F23(-1.5,2.75) G1(-1.25,-3.25) H2(-1,-2.75) H23(-1,2.75) J1(-0.75,-3.25) J24(-0.75,3.25) K2(-0.5,-2.75) L1(-0.25,-3.25) L24(-0.25,3.25) M2(0,-2.75) N1(0.25,-3.25) N24(0.25,3.25) P2(0.5,-2.75) P23(0.5,2.75) R1(0.75,-3.25) R24(0.75,3.25) T2(1,-2.75) T23(1,2.75) U1(1.25,-3.25) U24(1.25,3.25) V23(1.5,2.75) W1(1.75,-3.25) W24(1.75,3.25) Y2(2,-2.75) Y23(2,2.75)
C0402
  rect 0.5x0.54 smd: 1(-0.42,0) 2(0.42,0)
CRYSTAL-SMD_4P-L2.0-W1.6-BL-2
  rect 1.1x0.8 smd: 1(-0.8,-0.575) 2(0.8,-0.575) 3(0.8,0.575) 4(-0.8,0.575)
FC-12M_L2.0-W1.2
  rect 0.925x1.3 smd: 1(-0.863,0) 2(0.863,0)
L0402
  rect 0.54x0.54 smd: 1(-0.42,0) 2(0.42,0)
L0603
  rect 0.8x0.864 smd: 1(-0.7,0) 2(0.7,0)
LED0603-R-RD_WHITE
  rect 0.8x0.8 smd: 1(0.8,0) 2(-0.8,0)
LED0603-RD-YELLOW
  rect 0.8x0.8 smd: 1(-0.799,-0.004) 2(0.799,0.004)
mikoto-footprints:2.4GHz-meander-antenna-v2
  round 0.2 smd: 1(6.5,-1.5)
Pad_e629
  rrect 2x2 smd: 1(0,0)
Pad_e632
  rrect 2x2 smd: 1(0,0)
Pad_e1312
  round 2.5 hole 2: 1(0,0)
Pad_e2392
  round 1.8 smd far side: 1(0,0)
Pad_e2394
  round 1.8 smd far side: 1(0,0)
Pad_e2395
  round 1.8 smd far side: 1(0,0)
Pad_e2396
  round 1.8 smd far side: 1(0,0)
Pad_e2397
  round 1.8 smd far side: 1(0,0)
Pad_e2398
  round 1.8 smd far side: 1(0,0)
Pad_e2399
  round 1.8 smd far side: 1(0,0)
Pad_e2400
  round 1.8 smd: 1(0,0)
Pad_e2401
  round 1.8 smd far side: 1(0,0)
Pad_e2402
  round 1.8 smd far side: 1(0,0)
Pad_e2403
  round 1.8 smd far side: 1(0,0)
Pad_e2404
  round 1.8 smd far side: 1(0,0)
Pad_e2405
  round 1.8 smd far side: 1(0,0)
Pad_e2406
  round 1.8 smd: 1(0,0)
Pad_e2407
  round 1.8 smd: 1(0,0)
Pad_e2408
  round 1.8 smd: 1(0,0)
Pad_e2409
  round 1.8 smd: 1(0,0)
Pad_e2410
  round 1.8 smd: 1(0,0)
Pad_e2411
  round 1.8 smd: 1(0,0)
Pad_e2412
  round 1.8 smd: 1(0,0)
Pad_e7702
  round 2.5 hole 2: 1(0,0)
R0402
  rect 0.566x0.54 smd: 1(-0.433,0) 2(0.433,0)
R0603
  rect 0.806x0.864 smd: 1(-0.753,0) 2(0.753,0)
SOD-123_L2.7-W1.6-LS3.7-RD-1
  rect 1.2x0.95 smd: 1(-1.7,0) 2(1.7,0)
SOT-23-6_L2.9-W1.6-P0.95-LS2.8-BR
  rect 1.1x0.6 smd: 1(1.35,-0.95) 2(1.35,0) 3(1.35,0.95) 4(-1.35,0.95) 5(-1.35,0) 6(-1.35,-0.95)
SW-SMD_4P-L5.1-W5.1-P3.70-LS6.5-TL_H1.5
  rect 1x0.75 smd: 1(-3,1.875) 2(3,1.875) 3(-3,-1.875) 4(3,-1.875)
Test-Point-0.5mm
  rrect 1x1 smd: 1(0,0)
UDFN-6_L1.2-W1.0-P0.40-BL
  rect 0.224x0.585 smd: 1(-0.4,-0.417) 2(0,-0.417) 3(0.4,-0.417) 4(0.4,0.417) 5(0,0.417) 6(-0.4,0.417)
USB-C_SMD-TYPE-C-31-M-12_1
  oval 1.2x2 hole 0.8x1.6: 1(4.325,1.706) 4(-4.325,1.706)
  oval 1.2x1.8 hole 0.8x1.4: 2(4.325,-2.474) 3(-4.325,-2.474)
  custom 0.6x1.3 smd: A1B12(-3.2,2.474) A4B9(-2.4,2.474) B1A12(3.2,2.474) B4A9(2.401,2.474)
  rect 0.3x1.3 smd: A5(-1.25,2.474) A6(-0.25,2.474) A7(0.25,2.474) A8(1.25,2.474) B5(1.75,2.474) B6(0.75,2.474) B7(-0.75,2.474) B8(-1.75,2.474)

## Nets
GND: C2.1 C10.1 C11.1 C13.1 C14.1 C15.1 C16.1 C17.2 C18.2 C19.1 C20.1 C21.1 C22.1 C24.1 C25.1 C26.2 C27.1 C28.1 C29.1 C30.1 C31.1 C32.2 D2.1 GND.1 NOREF#3.1 NOREF#15.1 NOREF#16.1 R2.1 R3.1 R5.1 R7.1 R10.1 R12.2 SW1.3 SW1.4 U1.5 U2.0 U2.B7 U3.2 U3.4
VBAT: C11.2 C13.2 NOREF#5.1 R6.2 R9.1 U1.2 U2.Y2
VBUS: C28.2 D1.2 D2.6 U2.AD2 USBC1.A4B9 USBC1.B4A9
VDD_NRF: C14.2 C15.2 C16.2 C17.1 C18.1 L4.2 U2.A22 U2.AD14 U2.AD23 U2.B1 U2.W1
VSS_PA: C23.1 U2.F23
BAT_VOLT: C10.2 R7.2 R11.1 U2.J1
COL_0: NOREF#18.1 U2.U1
COL_1: NOREF.1 U2.A8
COL_2: NOREF#17.1 NOREF#21.1 U2.A10
COL_3: NOREF#7.1 U2.A12
COL_4: NOREF#12.1 U2.A14
COL_5: NOREF#9.1 U2.A16
COL_6: NOREF#24.1 U2.A20
COL_7: NOREF#2.1 U2.J24
COL_8: NOREF#11.1 U2.L24
COL_9: NOREF#19.1 U2.R24
COL_10: NOREF#20.1 U2.U24
COL_11: NOREF#10.1 U2.W24
COL_12: NOREF#23.1 U2.L1
COL_13: NOREF#4.1 U2.N1
RESET: SW1.1 SW1.2 U2.AC9 U2.AC11 U2.AC13
ROW_0: NOREF#14.1 U2.AD8
ROW_1: NOREF#22.1 U2.AD12
ROW_2: NOREF#8.1 U2.AD16
ROW_3: NOREF#6.1 U2.AD18
ROW_4: NOREF#13.1 U2.AD20
SWC: SWC.1 U2.AA24
SWD: SWD.1 U2.AC24
SWO: SWO.1 U2.AD22
USB_D+: D2.5 U2.AD6 USBC1.A6 USBC1.B6
USB_D-: D2.4 U2.AD4 USBC1.A7 USBC1.B7
YELLOW_LED: LED1.2 U2.AD10
$1N6787: R2.2 U1.1
$1N6836: R3.2 U1.4
$1N6843: C2.2 D1.1 U1.6
$1N6965: LED2.2 U1.3
$1N7006: LED2.1 R9.2
$1N7414: R10.2 USBC1.B5
$1N7418: R5.2 USBC1.A5
$1N7502: C4.2 R8.2 USBC1.A1B12 USBC1.B1A12
$1N7519: C4.1 R8.1 USBC1.1 USBC1.2 USBC1.3 USBC1.4
$1N7677: R6.1 R11.2
$1N7805: LED1.1 R12.1
$1N8689: C20.2 U2.A23 U3.3
$1N8693: C19.2 U2.B24 U3.1
$1N8922: C21.2 U2.D2 X1.2
$1N8937: C22.2 U2.F2 X1.1
$1N9163: C23.2 L3.2 U2.H23
$1N9226: C24.2 L3.1 R1.2
$1N9229: C25.2 R1.1
$1N9400: L4.1 U2.AB2
$1N9460: L2.1 U2.B3
$1N9502: L2.2 L5.1
$1N9506: C26.1 C27.2 L5.2 U2.B5 U2.E24
$1N9889: C29.2 U2.C1
$1N9928: C30.2 U2.D23
$1N9989: C31.2 U2.N24
$1N10054: C32.1 U2.AC5

Pads without a net: AE1 1; D2 2 3; U2 A18 AC15 AC17 AC19 AC21 B9 B11 B13 B15 B17 B19 G1 H2 K2 M2 P2 P23 R1 T2 T23 V23 Y23; USBC1 A8 B8

## Via types
v1: diameter 0.4, hole 0.2, Top Layer to Bottom Layer, 153 vias
v2: diameter 0.6, hole 0.3, Top Layer to Bottom Layer, 14 vias

## Routing (per net, layer and track width the routed paths; a pad name or vN(x,y) marks a point on that pad's centre or on a via; arc(x,y) is an arc through that point)
GND: length 33.6
  Top Layer w0.2: v1(48.25,7.71) 48.26,7.72 ; C25.1 v1(20.81,19.39) ; v1(18.42,19.39) 18.42,18.31 C24.1 ; v1(9.79,6.18) 9.92,6.06 11.56,6.06 12.28,6.78 12.28,7.2 ; C20.1 12.45,16.13 11.69,16.89 11.12,16.89 11.12,16.66 10.09,15.64 U3.2 ; U2.0 16.05,10.06 U2.B7 14.67,10.06 14.54,9.93 13.27,9.93 13.08,10.12 9.65,10.12 8.35,11.43 7.24,11.43 7.11,11.3 v1(7.11,11.14) ; C32.2 v1(23.94,6.69) ; R10.1 42.76,9.94 v1(43.14,9.56) ; v1(25.65,13.68) 25.48,13.5 25.48,12.41 25.06,11.99 C31.1 ; C13.1 20.87,6.98 v1(20.55,7.3) ; v1(40.13,5.04) 40.39,5.3 U1.5 ; v1(13.59,4.02) 13.17,4.44 C21.1 13.17,5.38 13.93,6.14 C29.1 ; v1(9.65,8.85) 10.01,9.21 11.07,9.21 11.72,8.56 11.94,8.56 C26.2 ; C22.1 17.78,4.07
  vias: v1(0.64,8.85) v1(0.76,16.47) v1(0.76,13.93) v1(0.76,11.39) v1(0.76,6.31) v1(0.76,3.52) v1(0.89,19.14) v1(0.89,0.85) v1(2.92,0.72) v1(5.59,19.27) v1(6.48,6.06) v1(6.48,0.72) v1(6.86,4.53) v1(8.66,4.53) v1(14.35,19.39) v1(15.37,19.39) v1(17.78,4.07) v1(28.07,6.82) v1(28.07,5.42) v1(28.07,4.19) v1(28.07,2.75) v1(28.19,13.8) v1(28.83,13.8) v1(28.96,5.42) v1(28.96,4.15) v1(28.99,2.75) v1(29.03,6.82) v1(29.21,10.38) v1(29.21,8.6) v1(29.97,5.42) v1(29.97,4.15) v1(29.99,2.75) v1(30.07,6.82) v1(30.35,8.6) v1(30.47,10.38) v1(31.09,6.82) v1(31.12,5.42) v1(31.12,4.15) v1(31.15,2.75) v1(31.33,10.38) v1(31.35,8.6) v1(32.26,6.82) v1(32.26,5.42) v1(32.26,4.15) v1(32.38,10.38) v1(32.35,8.6) v1(32.31,2.75) v1(32.45,13.81) v1(33.02,8.6) v1(33.27,10.38) v1(33.27,5.42) v1(33.27,4.15) v1(33.31,6.82) v1(33.32,2.75) v1(33.9,8.6) v1(34.29,10.38) v1(34.29,6.82) v1(34.3,13.81) v1(34.67,8.6) v1(34.67,4.15) v1(34.8,5.42) v1(35.3,10.38) v1(35.77,8.6) v1(36.32,10.38) v1(36.45,5.42) v1(36.83,8.34) v1(37.08,10.38) v1(37.59,13.8) v1(37.69,8.34) v1(38.23,10.38) v1(38.34,13.8) v1(38.48,8.34) v1(41.02,9.61) v1(41.4,7.33) v1(42.16,7.83) v1(42.42,6.32) v1(44.68,9.05) v1(44.7,10.57) v1(44.7,9.74) v1(44.83,7.83) v1(46.48,7.42) v1(46.48,6.31) v1(46.86,9.57) v1(46.99,10.76) v1(47.73,8.24) v1(47.74,7.71) v1(47.75,7.2) v1(48.26,8.22) v1(48.26,7.2) v1(48.76,8.22) v1(48.74,7.71) v1(48.77,7.2)
VBAT: length 44
  Top Layer w0.2: NOREF#5.1 v1(48.26,4.66) v1(48.77,4.66) v1(48.77,5.3) 48.77,5.8 v1(48.78,5.8) ; NOREF#5.1 v1(48.26,5.3) 48.22,5.34 v1(48.22,5.8) v1(47.62,5.8) v1(47.62,5.3) 47.62,5.17 NOREF#5.1 ; NOREF#5.1 48.01,4.91 47.62,4.91 v1(47.62,4.66) ; C13.2 20.03,7.37 19.9,7.49 v2(19.9,7.55) 19.69,7.76 19.69,8.68 U2.Y2
  Top Layer w0.5: C11.2 45.28,5.95 45.28,5.17 ; 45.28,5.17 47.62,5.17 ; 45.28,5.17 43.9,5.17 U1.2 42.66,5.3 42.16,4.8 v2(42.16,3.65) 42.16,3.06 41.99,2.88 R9.1 40.14,2.75 R6.2
  Bottom Layer w0.5: v2(42.16,3.65) 36.57,3.65 35.43,4.79 20.19,4.79 19.9,5.08 v2(19.9,7.55)
VBUS: length 37.9
  Top Layer w0.2: 46.6,12.35 46.6,13.05 45.72,13.93 ; 42.67,13.93 41.8,13.05 41.8,12.35 ; 41.91,8.85 43.06,8.85 D2.6 ; 22.44,8.09 21.84,8.09 v2(21.69,8.24) 21.12,8.81 U2.AD2
  Top Layer w0.5: 41.91,8.85 41.8,8.97 ; 41.8,8.97 41.8,12.35 ; 41.8,8.97 41.52,8.97 v2(39.92,7.37) 39.37,6.82 D1.2 ; 45.59,13.93 42.8,13.93
  Bottom Layer w0.5: v2(21.69,8.24) 21.69,6.59 22.22,6.06 38.61,6.06 v2(39.92,7.37)
VDD_NRF: length 57.3
  Top Layer w0.2: U2.AD14 21.06,11.56 v2(21.69,11.56) 22.48,11.56 C17.1 ; U2.AD23 21.08,14.31 21.4,13.99 21.87,13.99 C15.2 ; U2.W1 19.3,6.06 19.69,5.68 19.87,5.68 ; U2.B1 14.06,8.31 13.12,7.37 13.12,7.2 ; C14.2 12.62,13.81 v2(13.54,13.81) U2.A22
  Top Layer w0.5: v2(8,10.76) 7.49,10.25 7.49,7.45 9.4,5.55 11.61,5.55 ; 11.61,5.55 11.94,5.55 13.12,6.73 13.12,7.2 ; 11.61,5.55 11.61,4.86 13.08,3.39 18.92,3.39 19.56,4.02 ; 22.63,4.02 23.75,4.02 24.64,4.91 v2(24.64,8.34) ; 22.63,4.02 22.69,4.08 C18.1 ; 22.63,4.02 19.56,4.02 ; C15.2 22.82,11.9 C17.1 ; 19.56,4.02 19.87,4.34 L4.2 19.87,5.68
  Bottom Layer w0.5: v2(24.64,8.34) 23.5,8.34 21.69,10.15 v2(21.69,11.56) ; v2(8,10.76) 10.49,10.76 v2(13.54,13.81)
VSS_PA: length 6.2
  Top Layer w0.127: U2.F23 16.13,14.39 16.13,16.75 C23.1
  Top Layer w0.2: 17.55,11.56 16.05,13.06 U2.F23
BAT_VOLT: length 27
  Top Layer w0.2: 18.67,5.97 16.8,7.84 U2.J1
  Top Layer w0.5: R11.1 38.43,1.19 C10.2 34.76,1.19 v2(34.67,1.1) ; 18.67,5.97 v2(18.67,4.53)
  Bottom Layer w0.5: v2(34.67,1.1) 34.67,3.01 34.16,3.52 19.69,3.52 v2(18.67,4.53)
COL_0: length 17.8
  Top Layer w0.2: U2.U1 18.8,7.57 v1(18.43,7.2)
  Bottom Layer w0.2: NOREF#18.1 4.57,2.5 10.54,2.5 12.45,4.41 13.34,4.41 16.13,7.2 v1(18.43,7.2)
COL_1: length 17.2
  Top Layer w0.2: NOREF.1 2.54,5.04 4.32,6.82 4.32,9.23 6.81,11.73 8.56,11.73 9.85,10.43 14.18,10.43 U2.A8
COL_2: length 14.9
  Top Layer w0.2: U2.A10 9.98,10.81 8.76,12.03 6.35,12.03 2.41,8.09 2.41,7.78 2.21,7.58 NOREF#17.1
COL_3: length 14
  Top Layer w0.2: NOREF#7.1 2.54,10.12 5.08,12.66 8.76,12.66 10.11,11.31 U2.A12
COL_4: length 13.9
  Top Layer w0.2: U2.A14 10.25,11.81 8,14.06 3.94,14.06 2.54,12.66 NOREF#12.1
COL_5: length 13.6
  Top Layer w0.2: NOREF#9.1 7.4,15.2 10.29,12.31 U2.A16
COL_6: length 14.3
  Top Layer w0.2: U2.A20 14.26,13.27 9.75,13.27 7.06,15.96 4.32,15.96 2.54,17.74 NOREF#24.1
COL_7: length 25.2
  Top Layer w0.2: v1(16.89,15.58) 16.8,15.49 U2.J24
  Bottom Layer w0.2: v1(16.89,15.58) 16.89,13.93 11.18,8.22 8.51,8.22 6.6,10.12 6.6,16.22 5.08,17.74 NOREF#2.1
COL_8: length 24.5
  Top Layer w0.2: U2.L24 17.3,15.86 v1(17.31,15.87)
  Bottom Layer w0.2: v1(17.31,15.87) 17.4,15.78 17.4,13.93 11.3,7.83 8.13,7.83 6.22,9.74 6.22,14.06 5.08,15.2 NOREF#11.1
COL_9: length 22.4
  Top Layer w0.2: v1(18.31,15.45) 18.31,14.82 U2.R24
  Bottom Layer w0.2: v1(18.31,15.45) 18.31,14.2 11.56,7.45 7.87,7.45 5.84,9.49 5.84,11.77 4.95,12.66 NOREF#19.1
COL_10: length 20.9
  Top Layer w0.2: v1(18.81,15.45) 18.81,14.82 U2.U24
  Bottom Layer w0.2: NOREF#20.1 4.44,10.12 7.49,7.07 11.81,7.07 18.81,14.07 v1(18.81,15.45)
COL_11: length 20.8
  Top Layer w0.2: v1(19.31,15.45) 19.31,14.82 U2.W24
  Bottom Layer w0.2: v1(19.31,15.45) 19.31,13.94 12.08,6.71 5.95,6.71 5.08,7.58 NOREF#10.1
COL_12: length 18.7
  Top Layer w0.2: v1(17.64,7.66) 17.64,7.72 17.3,8.06 U2.L1 ; NOREF#23.1 3.43,3.39 v1(6.48,3.39)
  Bottom Layer w0.2: v1(17.64,7.66) 16.72,7.66 16.56,7.5 16,7.5 13.29,4.79 12.19,4.79 10.8,3.39 v1(6.48,3.39)
COL_13: length 17.6
  Top Layer w0.2: U2.N1 17.8,8.22 v1(18.31,7.71)
  Bottom Layer w0.2: NOREF#4.1 5.08,5.04 6.29,3.83 10.6,3.83 11.94,5.17 12.95,5.17 16,8.22 17.8,8.22 v1(18.31,7.71)
RESET: length 23.6
  Top Layer w0.2: v1(29.84,11.9) 29.84,12.96 SW1.1 SW1.2 ; v1(20.32,10.12) 20.32,10.54 U2.AC9 U2.AC11 U2.AC13
  Bottom Layer w0.2: v1(29.84,11.9) 28.32,11.9 27.94,11.52 27.94,7.58 27.69,7.33 23.5,7.33 20.7,10.12 v1(20.32,10.12)
ROW_0: length 21.3
  Top Layer w0.2: v2(14.48,2.12) 14.99,2.63 23.75,2.63 25.27,4.15 v1(25.27,7.87) ; v1(22.58,10.23) 22.5,10.31 U2.AD8
  Bottom Layer w0.2: v1(25.27,7.87) 25.27,8.72 24,9.99 22.86,9.99 22.62,10.23 v1(22.58,10.23)
ROW_1: length 20.5
  Top Layer w0.2: U2.AD12 21.06,11.06 23.21,11.06 v1(23.38,10.89) ; v1(25.78,7.84) 25.78,3.9 24.13,2.25 17.4,2.25 v2(17.02,1.87)
  Bottom Layer w0.2: v1(25.78,7.84) 25.78,8.77 23.66,10.89 v1(23.38,10.89)
ROW_2: length 19.7
  Top Layer w0.2: v1(21.64,12.47) 20.96,12.47 U2.AD16 ; v2(19.69,1.74) 24.4,1.74 26.31,3.64 v1(26.31,7.83)
  Bottom Layer w0.2: v1(21.64,12.47) 21.66,12.47 21.84,12.28 22.86,12.28 26.31,8.83 v1(26.31,7.83)
ROW_3: length 18.5
  Top Layer w0.2: v1(22.04,12.77) 21.94,12.87 20.86,12.87 U2.AD18 ; v1(26.92,7.83) 26.77,7.68 26.77,3.36 24.64,1.23 v2(22.48,1.23)
  Bottom Layer w0.2: v1(22.04,12.77) 22.88,12.77 26.92,8.72 v1(26.92,7.83)
ROW_4: length 17.3
  Top Layer w0.2: U2.AD20 20.91,13.31 21.05,13.17 21.84,13.17 v1(21.94,13.27) ; v1(27.43,7.83) 27.43,7.78 27.31,7.65 27.31,3.01 v1(26.03,1.74)
  Bottom Layer w0.2: v1(21.94,13.27) 22.89,13.27 27.43,8.72 v1(27.43,7.83) ; v1(26.03,1.74) NOREF#13.1
SWC: length 19.6
  Top Layer w0.2: v1(9.4,4.53) 9.1,4.24 SWC.1 ; v1(19.81,15.45) 19.81,14.82 U2.AA24
  Bottom Layer w0.2: v1(19.81,15.45) 19.81,13.93 12.19,6.31 10.92,6.31 9.4,4.79 v1(9.4,4.53)
SWD: length 19.7
  Top Layer w0.2: SWD.1 10.58,2.47 10.03,3.01 v1(10.03,4.55) ; v1(20.32,15.45) 20.32,14.83 U2.AC24
  Bottom Layer w0.2: v1(20.32,15.45) 20.32,13.93 12.32,5.93 11.05,5.93 10.03,4.91 10.03,4.53
SWO: length 19
  Top Layer w0.2: v1(10.67,4.53) 12.05,3.15 SWO.1 ; U2.AD22 20.82,13.81 20.97,13.66 20.99,13.66 21.08,13.57 v1(21.46,13.57)
  Bottom Layer w0.2: v1(21.46,13.57) 21.44,13.55 20.57,13.55 12.57,5.55 11.3,5.55 10.67,4.91 v1(10.67,4.53)
USB_D+: length 31.1
  Top Layer w0.158: v1(28.45,9.81) 28.09,9.81 28.02,9.74 21.15,9.74 21.08,9.81 U2.AD6 ; 43.52,8.98 43.52,9.82 43.45,9.89 v1(43.45,10.25) 43.45,10.61 43.52,10.68 43.52,11.47 43.45,11.54 43.45,13.18 43.69,13.42 44.2,13.42 44.45,13.17 44.45,12.35 44.45,12.35
  Bottom Layer w0.158: v1(28.45,9.81) 28.81,9.81 28.88,9.74 38.86,9.74 39.62,8.98 43.69,8.98 43.8,9.09 43.8,9.5 43.45,9.86 v1(43.45,10.25)
USB_D-: length 31.1
  Top Layer w0.158: 43.88,8.98 43.88,9.82 43.95,9.89 v1(43.95,10.25) 43.95,10.61 43.88,10.68 43.88,11.47 43.95,11.54 ; 43.95,12.35 43.95,11.54 ; 43.95,11.54 43.95,11.51 44.2,11.26 44.7,11.26 44.95,11.51 44.95,12.35 ; v1(28.45,9.31) 28.09,9.31 28.02,9.38 21.15,9.38 21.08,9.31 U2.AD4
  Bottom Layer w0.158: v1(28.45,9.31) 28.81,9.31 28.88,9.38 36.21,9.38 36.32,9.27 36.32,9.22 36.43,9.11 37.73,9.11 37.85,9.22 37.85,9.27 37.96,9.38 38.71,9.38 39.47,8.62 43.84,8.62 44.16,8.94 44.16,9.65 43.94,9.87 43.94,10.25 v1(43.95,10.25)
YELLOW_LED: length 8.5
  Top Layer w0.2: U2.AD10 20.86,10.76 22.76,10.76 23.27,10.25 24.89,10.25 25.78,11.14 25.78,12.66 26.33,13.21 LED1.2
$1N6787: length 1.6
  Top Layer w0.5: R2.2 44.94,4.34 U1.1
$1N6836: length 2.6
  Top Layer w0.5: U1.4 40.32,6.24 39.12,5.04 R3.2
$1N6843: length 8.5
  Top Layer w0.5: 37,3.73 37.12,3.73 37.29,3.9 40.75,3.9 41.07,4.22 U1.6 ; 37,3.73 35.69,5.04 35.69,6.52 D1.1 ; 37,3.73 C2.2
$1N6965: length 7.9
  Top Layer w0.2: LED2.2 44.2,1.23 v1(44.7,1.74) ; U1.3 v1(43.77,7.13)
  Bottom Layer w0.2: v1(43.77,7.13) 43.77,2.67 v1(44.7,1.74)
$1N7006: length 1.8
  Top Layer w0.4: LED2.1 42.85,1.96 R9.2
$1N7414: length 1.6
  Top Layer w0.2: 42.55,10.81 42.45,10.91 42.45,12.35
$1N7418: length 1.7
  Top Layer w0.2: 45.45,12.35 45.45,11.08 45.72,10.81
$1N7502: length 11.5
  Top Layer w0.2: 48.13,10.81 47.4,11.55 47.4,12.35 ; 40,10.92 v1(40.63,11.54) 41,11.91 41,12.35
  Bottom Layer w0.3: v1(40.63,11.54) 41.49,12.41 46.55,12.41 v1(47.63,11.32)
$1N7519: length 27
  Top Layer w0.2: C4.1 39.61,10.21 39.41,10.41 39.41,12.06 39.87,12.53 USBC1.1 ; USBC1.4 49.15,12.49 49.15,10.63 48.51,9.99 48.19,9.99 R8.1
  Bottom Layer w0.2: USBC1.4 USBC1.3 45.79,14.57 42.93,14.57 40.2,17.29 USBC1.2 USBC1.1
$1N7677: length 2.3
  Top Layer w0.4: R11.2 39.99,1.24 R6.1
$1N7805: length 1.9
  Top Layer w0.2: R12.1 27.91,12.59 LED1.1
$1N8689: length 3.7
  Top Layer w0.2: 11.12,15.54 11.37,15.29 C20.2 13.32,15.29 U2.A23
$1N8693: length 7.5
  Top Layer w0.2: 11.26,18.76 11.26,18.63 14.8,15.09 U2.B24 ; U3.1 10.09,17.55 10.99,18.44 10.99,18.69 10.92,18.76
$1N8922: length 5.5
  Top Layer w0.2: U2.D2 15.68,8.69 15.68,6.74 X1.2 15.01,5.17 14.26,5.17 C21.2
$1N8937: length 6.2
  Top Layer w0.2: X1.1 16.28,4.56 17.4,5.68 17.74,5.68 C22.2 17.78,6.44 16.76,7.45 16.48,7.45 15.98,7.96 15.98,8.74 U2.F2
$1N9163: length 4.5
  Top Layer w0.127: U2.H23 16.51,14.31 16.38,14.44 16.38,16.7 C23.2
  Top Layer w0.62: C23.2 L3.2
$1N9226: length 3.1
  Top Layer w0.62: R1.2 19.24,16.89 L3.1 19.24,17.15 C24.2
$1N9229: length 1.3
  Top Layer w0.62: C25.2 21.67,18.15 R1.1
$1N9400: length 4.5
  Top Layer w0.2: L4.1 21.65,5.54 21.65,6.76 20.07,8.34 20.07,8.8 U2.AB2
$1N9460: length 5.1
  Top Layer w0.2: U2.B3 13.21,9.06 12.83,8.68 12.83,8.34 12.45,7.96 10.99,7.96 L2.1
$1N9502: length 2.2
  Top Layer w0.2: L5.1 9.78,7.01 L2.2
$1N9506: length 19
  Top Layer w0.2: U2.B5 12.1,9.56 C26.1 11.98,9.61 v1(10.24,9.61) 8.95,9.61 8.76,9.42 ; U2.E24 15.8,15.45 v1(14.61,16.65) 14.61,17.19 C27.2
  Bottom Layer w0.2: v1(14.61,16.65) 14.61,12.41 11.81,9.61 v1(10.24,9.61)
$1N9889: length 1.7
  Top Layer w0.2: C29.2 14.48,7.45 15.3,8.28 U2.C1
$1N9928: length 5.5
  Top Layer w0.2: U2.D23 15.24,14.62 15.24,15.2 13.25,17.19 13.25,18.88
$1N9989: length 10.2
  Top Layer w0.2: v1(21.21,15.58) 20.94,15.86 18.07,15.86 17.8,15.58 U2.N24 ; C31.2 24.89,13.3 v1(24.51,13.68)
  Bottom Layer w0.2: v1(24.51,13.68) 22.1,13.68 21.72,14.06 21.46,14.06 21.21,14.31 v1(21.21,15.58)
$1N10054: length 3.9
  Top Layer w0.2: 22.44,6.69 22.22,6.69 20.45,8.47 20.45,9.41 U2.AC5

## Copper pours and planes (outline as drawn; the poured copper is in the pictures)
GND on Top Layer: -1.27,23.2 51.18,23.2 51.18,-0.55 -1.27,-0.55
GND on Bottom Layer: -0.13,22.57 51.18,22.57 51.18,-1.31 -0.13,-1.31

Small or netless copper shapes (teardrops, artwork), in the pictures only: 226 on Top Layer, 63 on Bottom Layer

## Text on the board
Bottom Silkscreen Layer: PHOTON | Col 8 | Col 7 | Col 9 | Col 10 | Col 11 | Col 13 | Col 0 | ROW 0 | ROW 1 | ROW 2 | ROW 3 | ROW 4
Top Solder Mask Layer: SAYMON ISLAM
Top Silkscreen Layer: R5 | R1 | GND | SWC | SWD | Col 6 | Col 4 | Col 5 | Col 3 | Col 2 | Col 1 | Col 12
